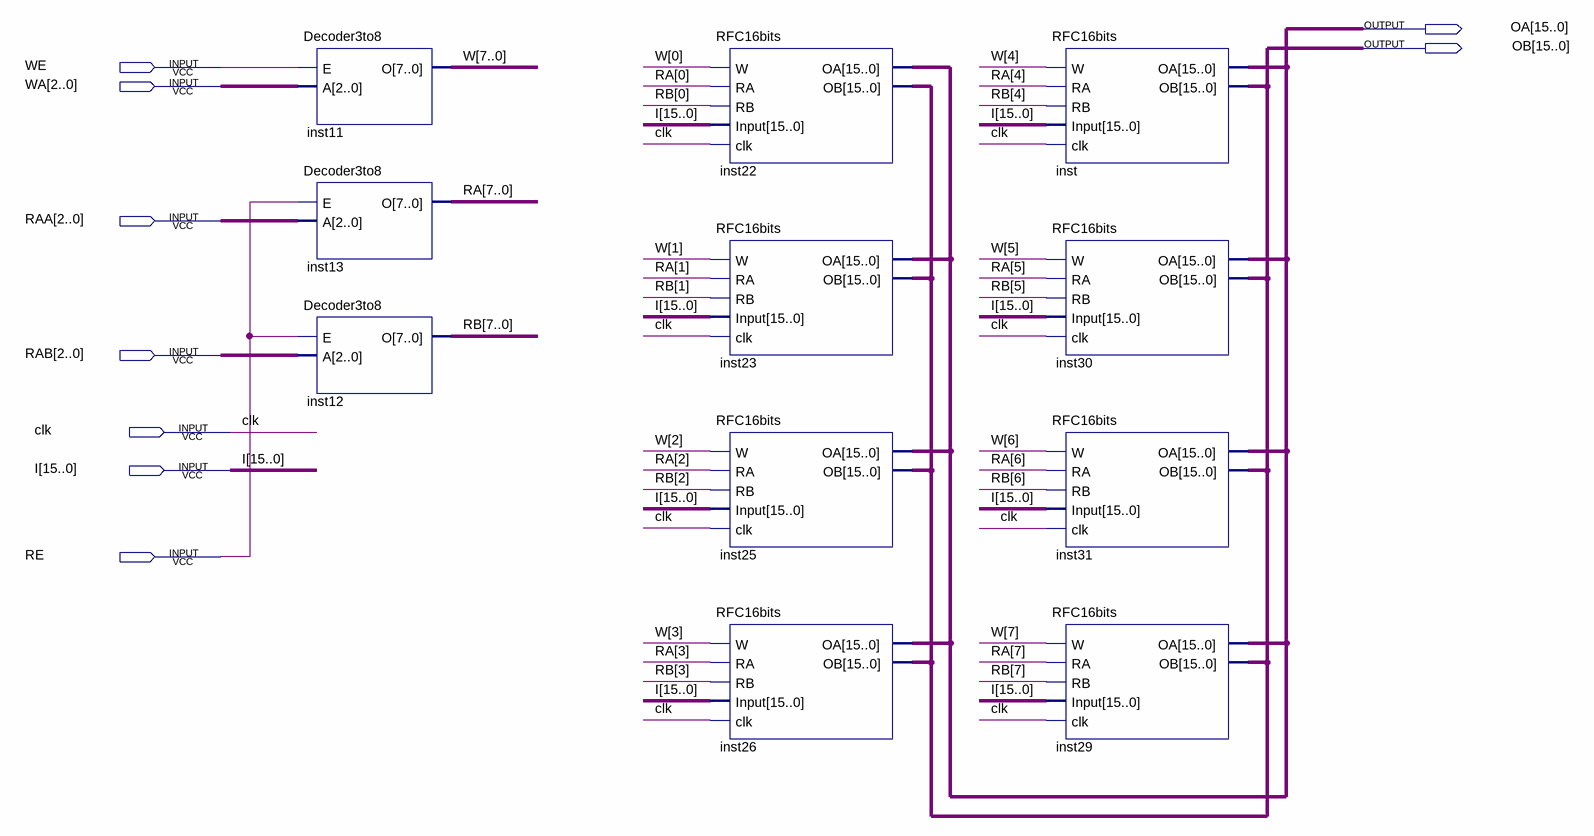
[diagram p0: schematic sheet]
// Quartus schematic RF8-16.bdf as structural Verilog: 11 symbols, 9 pins
module \RF8-16  (
  input  WE,
  input  [2:0] WA,
  input  [2:0] RAA,
  input  [2:0] RAB,
  input  clk,
  input  [15:0] I,
  input  RE,
  output [15:0] OA,
  output [15:0] OB
);

  wire [7:0] RA, RB, W;

  Decoder3to8 inst11 (.E(WE), .A(WA), .O(W));
  Decoder3to8 inst13 (.E(RE), .A(RAA), .O(RA));
  Decoder3to8 inst12 (.E(RE), .A(RAB), .O(RB));
  RFC16bits inst22 (.W(W[0]), .RA(RA[0]), .RB(RB[0]), .Input(I), .clk(clk), .OA(OA), .OB(OB));
  RFC16bits inst23 (.W(W[1]), .RA(RA[1]), .RB(RB[1]), .Input(I), .clk(clk), .OA(OA), .OB(OB));
  RFC16bits inst25 (.W(W[2]), .RA(RA[2]), .RB(RB[2]), .Input(I), .clk(clk), .OA(OA), .OB(OB));
  RFC16bits inst26 (.W(W[3]), .RA(RA[3]), .RB(RB[3]), .Input(I), .clk(clk), .OA(OA), .OB(OB));
  RFC16bits inst (.W(W[4]), .RA(RA[4]), .RB(RB[4]), .Input(I), .clk(clk), .OA(OA), .OB(OB));
  RFC16bits inst30 (.W(W[5]), .RA(RA[5]), .RB(RB[5]), .Input(I), .clk(clk), .OA(OA), .OB(OB));
  RFC16bits inst31 (.W(W[6]), .RA(RA[6]), .RB(RB[6]), .Input(I), .clk(clk), .OA(OA), .OB(OB));
  RFC16bits inst29 (.W(W[7]), .RA(RA[7]), .RB(RB[7]), .Input(I), .clk(clk), .OA(OA), .OB(OB));
endmodule
